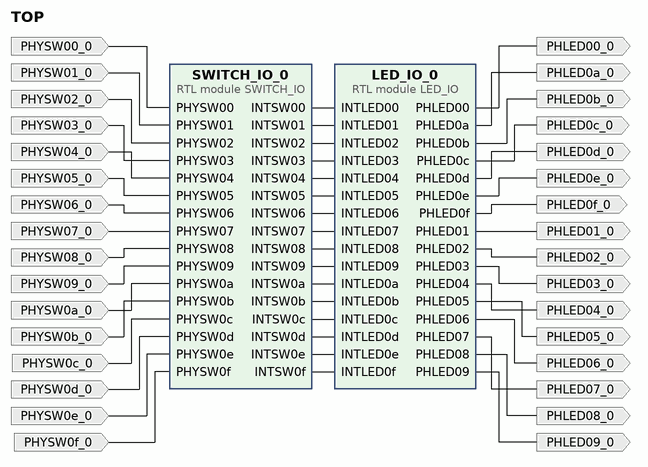
[diagram p0: block diagram of the top level]
# Vivado block design TOP, xc7a100tcsg324-1, Vivado 2019.2
create_bd_design TOP

create_bd_port -dir I PHYSW00_0
create_bd_port -dir I PHYSW01_0
create_bd_port -dir I PHYSW02_0
create_bd_port -dir I PHYSW03_0
create_bd_port -dir I PHYSW04_0
create_bd_port -dir I PHYSW05_0
create_bd_port -dir I PHYSW06_0
create_bd_port -dir I PHYSW07_0
create_bd_port -dir I PHYSW08_0
create_bd_port -dir I PHYSW09_0
create_bd_port -dir I PHYSW0a_0
create_bd_port -dir I PHYSW0b_0
create_bd_port -dir I PHYSW0c_0
create_bd_port -dir I PHYSW0d_0
create_bd_port -dir I PHYSW0e_0
create_bd_port -dir I PHYSW0f_0
create_bd_port -dir O PHLED00_0
create_bd_port -dir O PHLED01_0
create_bd_port -dir O PHLED02_0
create_bd_port -dir O PHLED03_0
create_bd_port -dir O PHLED04_0
create_bd_port -dir O PHLED05_0
create_bd_port -dir O PHLED06_0
create_bd_port -dir O PHLED07_0
create_bd_port -dir O PHLED08_0
create_bd_port -dir O PHLED09_0
create_bd_port -dir O PHLED0a_0
create_bd_port -dir O PHLED0b_0
create_bd_port -dir O PHLED0c_0
create_bd_port -dir O PHLED0d_0
create_bd_port -dir O PHLED0e_0
create_bd_port -dir O PHLED0f_0

create_bd_cell -type module -reference LED_IO LED_IO_0
create_bd_cell -type module -reference SWITCH_IO SWITCH_IO_0

# ---- connections ----

connect_bd_net [get_bd_pins SWITCH_IO_0/INTSW00] [get_bd_pins LED_IO_0/INTLED00]
connect_bd_net [get_bd_pins SWITCH_IO_0/INTSW01] [get_bd_pins LED_IO_0/INTLED01]
connect_bd_net [get_bd_pins SWITCH_IO_0/INTSW02] [get_bd_pins LED_IO_0/INTLED02]
connect_bd_net [get_bd_pins SWITCH_IO_0/INTSW03] [get_bd_pins LED_IO_0/INTLED03]
connect_bd_net [get_bd_pins SWITCH_IO_0/INTSW04] [get_bd_pins LED_IO_0/INTLED04]
connect_bd_net [get_bd_pins SWITCH_IO_0/INTSW05] [get_bd_pins LED_IO_0/INTLED05]
connect_bd_net [get_bd_pins SWITCH_IO_0/INTSW06] [get_bd_pins LED_IO_0/INTLED06]
connect_bd_net [get_bd_pins SWITCH_IO_0/INTSW07] [get_bd_pins LED_IO_0/INTLED07]
connect_bd_net [get_bd_pins SWITCH_IO_0/INTSW08] [get_bd_pins LED_IO_0/INTLED08]
connect_bd_net [get_bd_pins SWITCH_IO_0/INTSW09] [get_bd_pins LED_IO_0/INTLED09]
connect_bd_net [get_bd_pins SWITCH_IO_0/INTSW0a] [get_bd_pins LED_IO_0/INTLED0a]
connect_bd_net [get_bd_pins SWITCH_IO_0/INTSW0b] [get_bd_pins LED_IO_0/INTLED0b]
connect_bd_net [get_bd_pins SWITCH_IO_0/INTSW0c] [get_bd_pins LED_IO_0/INTLED0c]
connect_bd_net [get_bd_pins SWITCH_IO_0/INTSW0d] [get_bd_pins LED_IO_0/INTLED0d]
connect_bd_net [get_bd_pins SWITCH_IO_0/INTSW0e] [get_bd_pins LED_IO_0/INTLED0e]
connect_bd_net [get_bd_pins SWITCH_IO_0/INTSW0f] [get_bd_pins LED_IO_0/INTLED0f]
connect_bd_net -net PHYSW00_0_1 [get_bd_ports PHYSW00_0] [get_bd_pins SWITCH_IO_0/PHYSW00]
connect_bd_net -net PHYSW01_0_1 [get_bd_ports PHYSW01_0] [get_bd_pins SWITCH_IO_0/PHYSW01]
connect_bd_net -net PHYSW02_0_1 [get_bd_ports PHYSW02_0] [get_bd_pins SWITCH_IO_0/PHYSW02]
connect_bd_net -net PHYSW03_0_1 [get_bd_ports PHYSW03_0] [get_bd_pins SWITCH_IO_0/PHYSW03]
connect_bd_net -net PHYSW04_0_1 [get_bd_ports PHYSW04_0] [get_bd_pins SWITCH_IO_0/PHYSW04]
connect_bd_net -net PHYSW05_0_1 [get_bd_ports PHYSW05_0] [get_bd_pins SWITCH_IO_0/PHYSW05]
connect_bd_net -net PHYSW06_0_1 [get_bd_ports PHYSW06_0] [get_bd_pins SWITCH_IO_0/PHYSW06]
connect_bd_net -net PHYSW07_0_1 [get_bd_ports PHYSW07_0] [get_bd_pins SWITCH_IO_0/PHYSW07]
connect_bd_net -net PHYSW08_0_1 [get_bd_ports PHYSW08_0] [get_bd_pins SWITCH_IO_0/PHYSW08]
connect_bd_net -net PHYSW09_0_1 [get_bd_ports PHYSW09_0] [get_bd_pins SWITCH_IO_0/PHYSW09]
connect_bd_net -net PHYSW0a_0_1 [get_bd_ports PHYSW0a_0] [get_bd_pins SWITCH_IO_0/PHYSW0a]
connect_bd_net -net PHYSW0b_0_1 [get_bd_ports PHYSW0b_0] [get_bd_pins SWITCH_IO_0/PHYSW0b]
connect_bd_net -net PHYSW0c_0_1 [get_bd_ports PHYSW0c_0] [get_bd_pins SWITCH_IO_0/PHYSW0c]
connect_bd_net -net PHYSW0d_0_1 [get_bd_ports PHYSW0d_0] [get_bd_pins SWITCH_IO_0/PHYSW0d]
connect_bd_net -net PHYSW0e_0_1 [get_bd_ports PHYSW0e_0] [get_bd_pins SWITCH_IO_0/PHYSW0e]
connect_bd_net -net PHYSW0f_0_1 [get_bd_ports PHYSW0f_0] [get_bd_pins SWITCH_IO_0/PHYSW0f]
connect_bd_net [get_bd_pins LED_IO_0/PHLED00] [get_bd_ports PHLED00_0]
connect_bd_net [get_bd_pins LED_IO_0/PHLED01] [get_bd_ports PHLED01_0]
connect_bd_net [get_bd_pins LED_IO_0/PHLED02] [get_bd_ports PHLED02_0]
connect_bd_net [get_bd_pins LED_IO_0/PHLED03] [get_bd_ports PHLED03_0]
connect_bd_net [get_bd_pins LED_IO_0/PHLED04] [get_bd_ports PHLED04_0]
connect_bd_net [get_bd_pins LED_IO_0/PHLED05] [get_bd_ports PHLED05_0]
connect_bd_net [get_bd_pins LED_IO_0/PHLED06] [get_bd_ports PHLED06_0]
connect_bd_net [get_bd_pins LED_IO_0/PHLED07] [get_bd_ports PHLED07_0]
connect_bd_net [get_bd_pins LED_IO_0/PHLED08] [get_bd_ports PHLED08_0]
connect_bd_net [get_bd_pins LED_IO_0/PHLED09] [get_bd_ports PHLED09_0]
connect_bd_net [get_bd_pins LED_IO_0/PHLED0a] [get_bd_ports PHLED0a_0]
connect_bd_net [get_bd_pins LED_IO_0/PHLED0b] [get_bd_ports PHLED0b_0]
connect_bd_net [get_bd_pins LED_IO_0/PHLED0c] [get_bd_ports PHLED0c_0]
connect_bd_net [get_bd_pins LED_IO_0/PHLED0d] [get_bd_ports PHLED0d_0]
connect_bd_net [get_bd_pins LED_IO_0/PHLED0e] [get_bd_ports PHLED0e_0]
connect_bd_net [get_bd_pins LED_IO_0/PHLED0f] [get_bd_ports PHLED0f_0]

validate_bd_design
save_bd_design
